# Altium schematic sheet ESP32.SchDoc
size A4; DrawnBy: Emile Renaud; Revision: V1.0; SheetNumber: 2; SheetTotal: 3
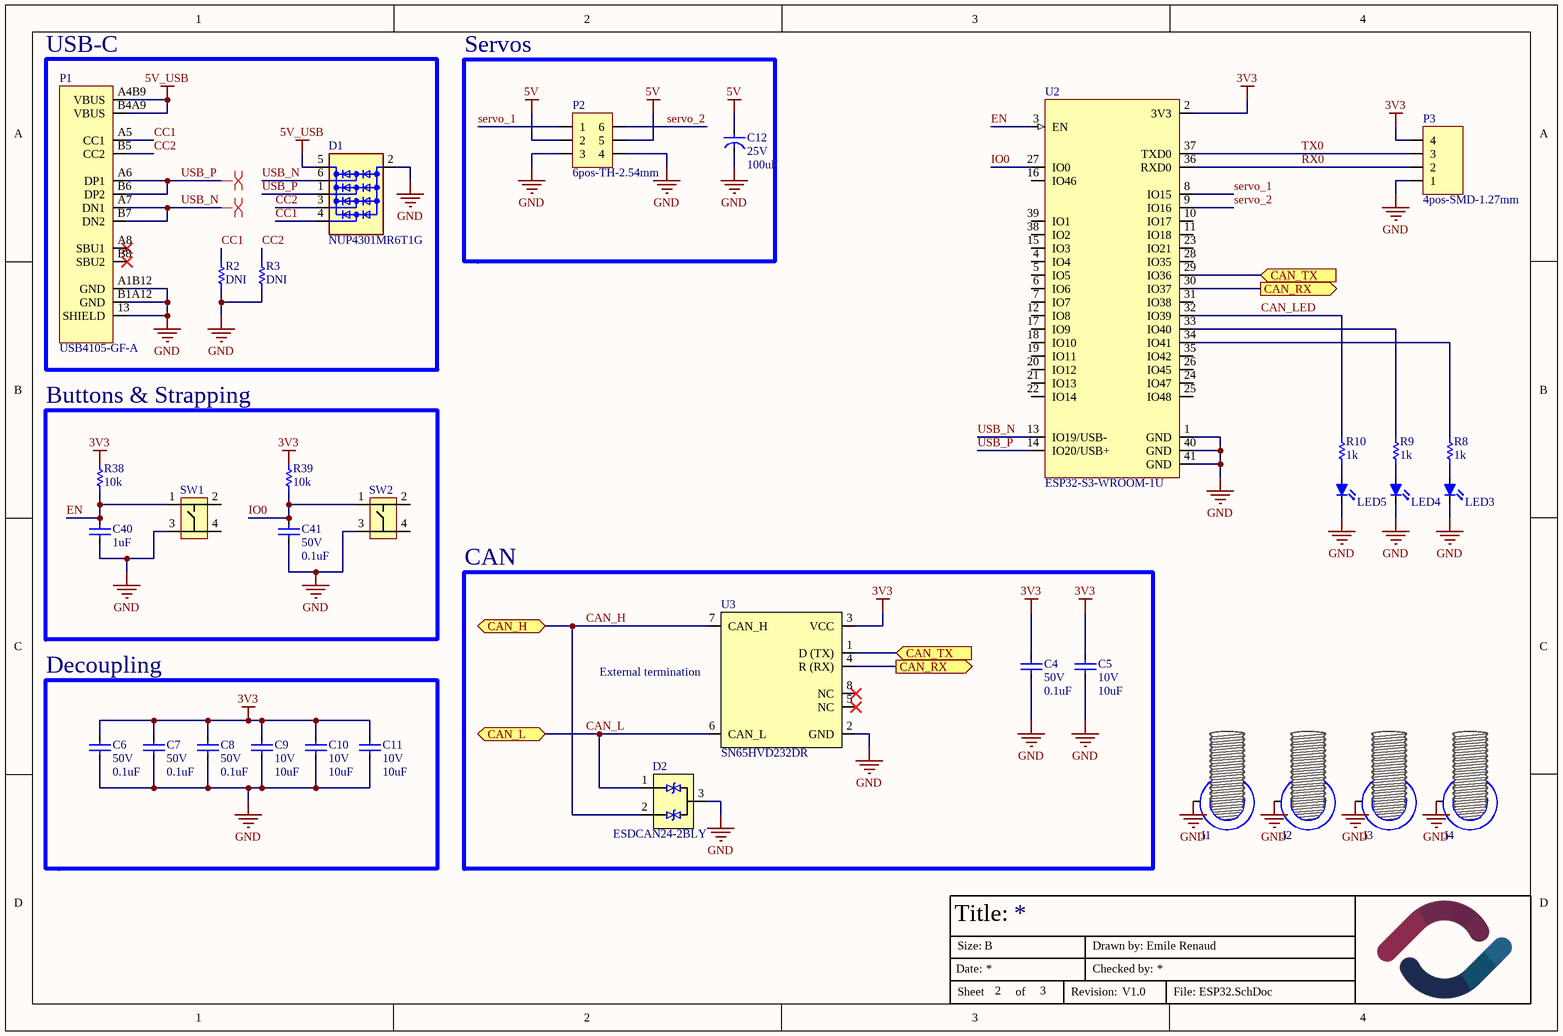
[diagram p0: ESP32.SchDoc]

## Parts
C4  value 0.1uF  Volt: 50V  [CAPACITOR-0603]  (hidden comment: Capacitor-0603-0.1uF-50V-X7R)
C5  value 10uF  Volt: 10V  [CAPACITOR-0603]  (hidden comment: Capacitor-0603-10uF-10V-X5R)
C6  value 0.1uF  Volt: 50V  [CAPACITOR-0603]  (hidden comment: Capacitor-0603-0.1uF-50V-X7R)
C7  value 0.1uF  Volt: 50V  [CAPACITOR-0603]  (hidden comment: Capacitor-0603-0.1uF-50V-X7R)
C8  value 0.1uF  Volt: 50V  [CAPACITOR-0603]  (hidden comment: Capacitor-0603-0.1uF-50V-X7R)
C9  value 10uF  Volt: 10V  [CAPACITOR-0603]  (hidden comment: Capacitor-0603-10uF-10V-X5R)
C10  value 10uF  Volt: 10V  [CAPACITOR-0603]  (hidden comment: Capacitor-0603-10uF-10V-X5R)
C11  value 10uF  Volt: 10V  [CAPACITOR-0603]  (hidden comment: Capacitor-0603-10uF-10V-X5R)
C12  value 100uF  Volt: 25V  [CAPACITOR-Aluminium-5x11mm-2mmPitch - SIDE]  (hidden comment: CAP ALUM 100UF 20% 25V RADIAL SIDE)
C40  value 1uF  [CAPACITOR-0603]  (hidden comment: Capacitor-0603-1uF-25V-X5R)
C41  value 0.1uF  Volt: 50V  [CAPACITOR-0603]  (hidden comment: Capacitor-0603-0.1uF-50V-X7R)
D1  NUP4301MR6T1G  [SOT-23-6]
D2  ESDCAN24-2BLY  [SOT-23-3]
J1  hole  [HOLE-3.40MM-M3-8MMEYELET]  (value not drawn)  (no BOM)
J2  hole  [HOLE-3.40MM-M3-8MMEYELET]  (value not drawn)  (no BOM)
J3  hole  [HOLE-3.40MM-M3-8MMEYELET]  (value not drawn)  (no BOM)
J4  hole  [HOLE-3.40MM-M3-8MMEYELET]  (value not drawn)  (no BOM)
LED3  3147-B1931NB--20C007614U1930CT-ND  [LED-0603-2PIN-SILKSCREEN]  (value not drawn)
LED4  3147-B1931NB--20C007614U1930CT-ND  [LED-0603-2PIN-SILKSCREEN]  (value not drawn)
LED5  3147-B1931NB--20C007614U1930CT-ND  [LED-0603-2PIN-SILKSCREEN]  (value not drawn)
P1  USB4105-GF-A  [USB-C]
P2  6pos-TH-2.54mm  [HDR2X3]
P3  4pos-SMD-1.27mm  [HDR1X4-SMD-50mils]
R2  value DNI  [RESISTOR-0603]  (hidden comment: Resistor-0603-5.1k)
R3  value DNI  [RESISTOR-0603]  (hidden comment: Resistor-0603-5.1k)
R8  value 1k  [Resistor-0603]  (hidden comment: SMT resistor)
R9  value 1k  [Resistor-0603]  (hidden comment: SMT resistor)
R10  value 1k  [Resistor-0603]  (hidden comment: SMT resistor)
R38  value 10k  [Resistor-0603]  (hidden comment: SMT resistor)
R39  value 10k  [Resistor-0603]  (hidden comment: SMT resistor)
SW1  PTS815 SJM 250 SMTR LFS  [SW4_PTS815 SJM 250 SMTR LFS_CNK]  (value not drawn)
SW2  PTS815 SJM 250 SMTR LFS  [SW4_PTS815 SJM 250 SMTR LFS_CNK]  (value not drawn)
U2  ESP32-S3-WROOM-1U  [ESP32-S3-WROOM-1U]
U3  SN65HVD232DR  [SOIC-8]

## Blocks framed on the sheet
USB-C: D1 P1 R2 R3
Servos: C12 P2
Buttons & Strapping: C40 C41 R38 R39 SW1 SW2
CAN: C4 C5 D2 U3
Decoupling: C6-C11

## Ports
CAN_H (bidir), CAN_L (bidir), CAN_RX (out), CAN_TX (in)

## Nets
3V3: C4.2 C5.2 C6.2 C7.2 C8.2 C9.2 C10.2 C11.2 P3.4 R38.2 R39.2 U2.2(3V3) U3.3(VCC)
5V: C12.1 P2.2 P2.5
5V_USB: D1.5(VDD) P1.A4B9(VBUS) P1.B4A9(VBUS)
GND: C4.1 C5.1 C6.1 C7.1 C8.1 C9.1 C10.1 C11.1 C12.2 C40.1 C41.1 D1.2(GND) D2.3(L3) J1.1 J2.1 J3.1 J4.1 LED3.1(K) LED4.1(K) LED5.1(K) P1.13(SHIELD) P1.A1B12(GND) P1.B1A12(GND) P2.3 P2.4 P3.1 R2.1 R3.1 SW1.3 SW2.3 U2.1(GND) U2.40(GND) U2.41(GND) U3.2(GND)
CAN_H: D2.2(GND) U3.7(CAN_H) ; port CAN_H
CAN_L: D2.1(L2) U3.6(CAN_L) ; port CAN_L
CAN_LED: R10.2 U2.32(IO39)
CAN_RX: U2.30(IO37) U3.4(R_(RX)) ; port CAN_RX
CAN_TX: U2.29(IO36) U3.1(D_(TX)) ; port CAN_TX
CC1: D1.4(L4) P1.A5(CC1) R2.2
CC2: D1.3(L3) P1.B5(CC2) R3.2
EN: C40.2 R38.1 SW1.1 U2.3(EN)
IO0: C41.2 R39.1 SW2.1 U2.27(IO0)
RX0: P3.2 U2.36(RXD0)
servo_1: P2.1 U2.8(IO15)
servo_2: P2.6 U2.9(IO16)
TX0: P3.3 U2.37(TXD0)
USB_N: D1.6(L1) P1.A7(DN1) P1.B7(DN2) U2.13(IO19/USB-)
USB_P: D1.1(L2) P1.A6(DP1) P1.B6(DP2) U2.14(IO20/USB+)
NetLED3_2: LED3.2(R) R8.1
NetLED4_2: LED4.2(R) R9.1
NetLED5_2: LED5.2(R) R10.1
NetR8_2: R8.2 U2.34(IO41)
NetR9_2: R9.2 U2.33(IO40)

Not connected (* = marked no-connect by the designer): P1 A8(SBU1)* B8(SBU2)*; SW1 2 4; SW2 2 4; U2 4(IO4) 5(IO5) 6(IO6) 7(IO7) 10(IO17) 11(IO18) 12(IO8) 15(IO3) 16(IO46) 17(IO9) 18(IO10) 19(IO11) 20(IO12) 21(IO13) 22(IO14) 23(IO21) 24(IO47) 25(IO48) 26(IO45) 28(IO35) 31(IO38) 35(IO42) 38(IO2) 39(IO1); U3 5(NC)* 8(NC)*

## Layout directives
differential pair; differential pair class USB: USB_N, USB_P

## Notes on the sheet
- (near U3) External termination
- Title:
- Date:
- Size:
- B
- Drawn by:
- Checked by:
- Sheet
- of
- Revision:
- File:

## Library data of the parts
C4 C6-C8 C41 = Capacitor-0603-0.1uF-50V-X7R: Precision: X7R-10%; Package / Case: Metric 1608, EIA 0603; Mounted: Yes; Supplier 1: Digi-Key; Supplier Part Number 1: 1276-1935-2-ND; Supplier 2: Digi-Key; Supplier Part Number 2: 1276-1934-2-ND
C5 C9-C11 = Capacitor-0603-10uF-10V-X5R: 10 µF ±20% 10V Ceramic Capacitor X5R 0603 (1608 Metric); Supplier 1: Digikey; Supplier Part Number 1: 4713-GMC10X5R106M10NTCT-ND; Mounted: Yes; Package / Case: Metric 1608 , EIA 0603; Precision: 20%
C12 = Capacitor-100uF-25V-Side: CAP ALUM 100UF 20% 25V RADIAL; Precision: 20%; Mounted: Yes; Supplier 1: Digi-Key; Supplier Part Number 1: 399-6102-ND; Supplier 2: Digi-Key
C40 = Capacitor-0603-1uF-25V-X5R: Precision: X5R-10%; Volt: 25V; Package / Case: Metric 1608, EIA 0603; Mounted: Yes; Supplier 1: Digi-Key; Supplier Part Number 1: 1276-1859-2-ND; Supplier 2: Digi-Key; Supplier Part Number 2: 1276-1942-2-ND
D1 = NUP4301MR6T1G: 4CH Clamp Ipp Tvs Diode Surface Mount SOT23-6 (SC74); Volt: 70; Supplier 1: Digi-Key; Supplier Part Number 1: NUP4301MR6T1GOSTR-ND; Mounted: Yes; Package / Case: SOT23-6
D2 = ESDCAN24-2BLY: 55V Clamp 6A (8/20µs) Ipp Tvs Diode Surface Mount SOT-23; Volt: 24; Supplier 1: Digi-Key; Supplier Part Number 1: 5272-ESDCAN24-2BLYCT-ND; Mounted: Yes; Package / Case: SOT-23-3
J1-J4 = Hole 3.40mm M3-Eyelet: Hole for M3 Bolt with 8mm pad; Mounted: N/A
LED3-LED5 = LED_BLUE: LED BLUE CLEAR 0603 SMD; Package / Case: 0603 (1608 Metric); Mounted: Yes; Supplier 1: Digi-Key; Supplier Part Number 1: 3147-B1931NB--20C007614U1930CT-ND
P1 = USB4105-GF-A: CONN RCP USB2.0 TYP C 24P SMD RA / 5A; Supplier 1: Digikey; Supplier Part Number 1: 2073-USB4105-GF-ACT-ND; Mounted: Yes; Package / Case: SMD; Volt: N/A
P2 = 6pos-TH-2.54mm 2x3: 6pos TH 2.54mm Header; Supplier 1: Digi-Key; Supplier Part Number 1: 952-2092-ND; Mounted: Yes; Package / Case: TH; Volt: N/A
P3 = 4pos-SMD-1.27mm: 4pos SMD 1.27mm; Supplier 1: Digi-Key; Supplier Part Number 1: N/A; Mounted: Yes; Package / Case: TH; Volt: N/A
R2 R3 = Resistor-0603-DNI: 0603 footprint DO NOT INSTALL; Mounted: Yes; Package/Case: Metric 1608 , EIA 0603
R8-R10 = Resistor-0603-1k: Resistor0603-1k; Precision: 1%; Watt: 0.1W; Mounted: Yes; Package / Case: Metric 1608, EIA 0603; Supplier 1: Digi-Key; Supplier Part Number 1: 311-1.00KHRCT-ND
R38 R39 = Resistor0603-10k: Precision: 1%; Watt: 0.1W; Mounted: Yes; Package / Case: Metric 1608, EIA 0603; Supplier 2: Digi-Key; Supplier 4: Digi-Key; Supplier Part Number 2: RMCF0603FT10K0TR-ND; Supplier 1: Digi-Key; Supplier 3: Digi-Key; Supplier Part Number 1: 311-10.0KHRTR-ND
SW1 SW2 = PTS815 SJM 250 SMTR LFS: TACT 4.2 X 3.2, 2.5 MM H, 180GF,; Volt: 12V; Current: 0.05A; Supplier 1: Digi-Key; Supplier Part Number 1: CKN12215-1-ND; Mounted: Yes
U2 = ESP32-S3-WROOM-1U: 2.4 GHz Wi-Fi (802.11 b/g/n) and Bluetooth 5 (LE) module; MF: Espressif Systems; Value: *; Package: Package; MP: ESP32-S3-WROOM-1U; Supplier 1: Digikey; Supplier Part Number 1: 1965-ESP32-S3-WROOM-1U-N8R8CT-ND
U3 = SN65HVD232DR: 1/1 Transceiver Half CANbus 8-SOIC; Package / Case: 8-SOIC; Mounted: Yes; Supplier 1: Digikey; Supplier Part Number 1: 296-26344-1-ND; HelpURL: https://www.ti.com/lit/ds/symlink/sn65hvd230.pdf?HQS=dis-dk-null-digikeymode-dsf-pf-null-wwe&ts=1723930967656&ref_url=https%253A%252F%252Fwww.ti.com%252Fgeneral%252Fdocs%252Fsuppproductinfo.tsp%253FdistId%253D10%2526gotoUrl%253Dhttps%253A%252F%252Fwww.ti.com%252Flit%252Fgpn%252Fsn65hvd230